# EAGLE schematic BORC_v2_control_board (EAGLE 9.6.2)

## Sheet 1 of 4: Main Processor & interfaces
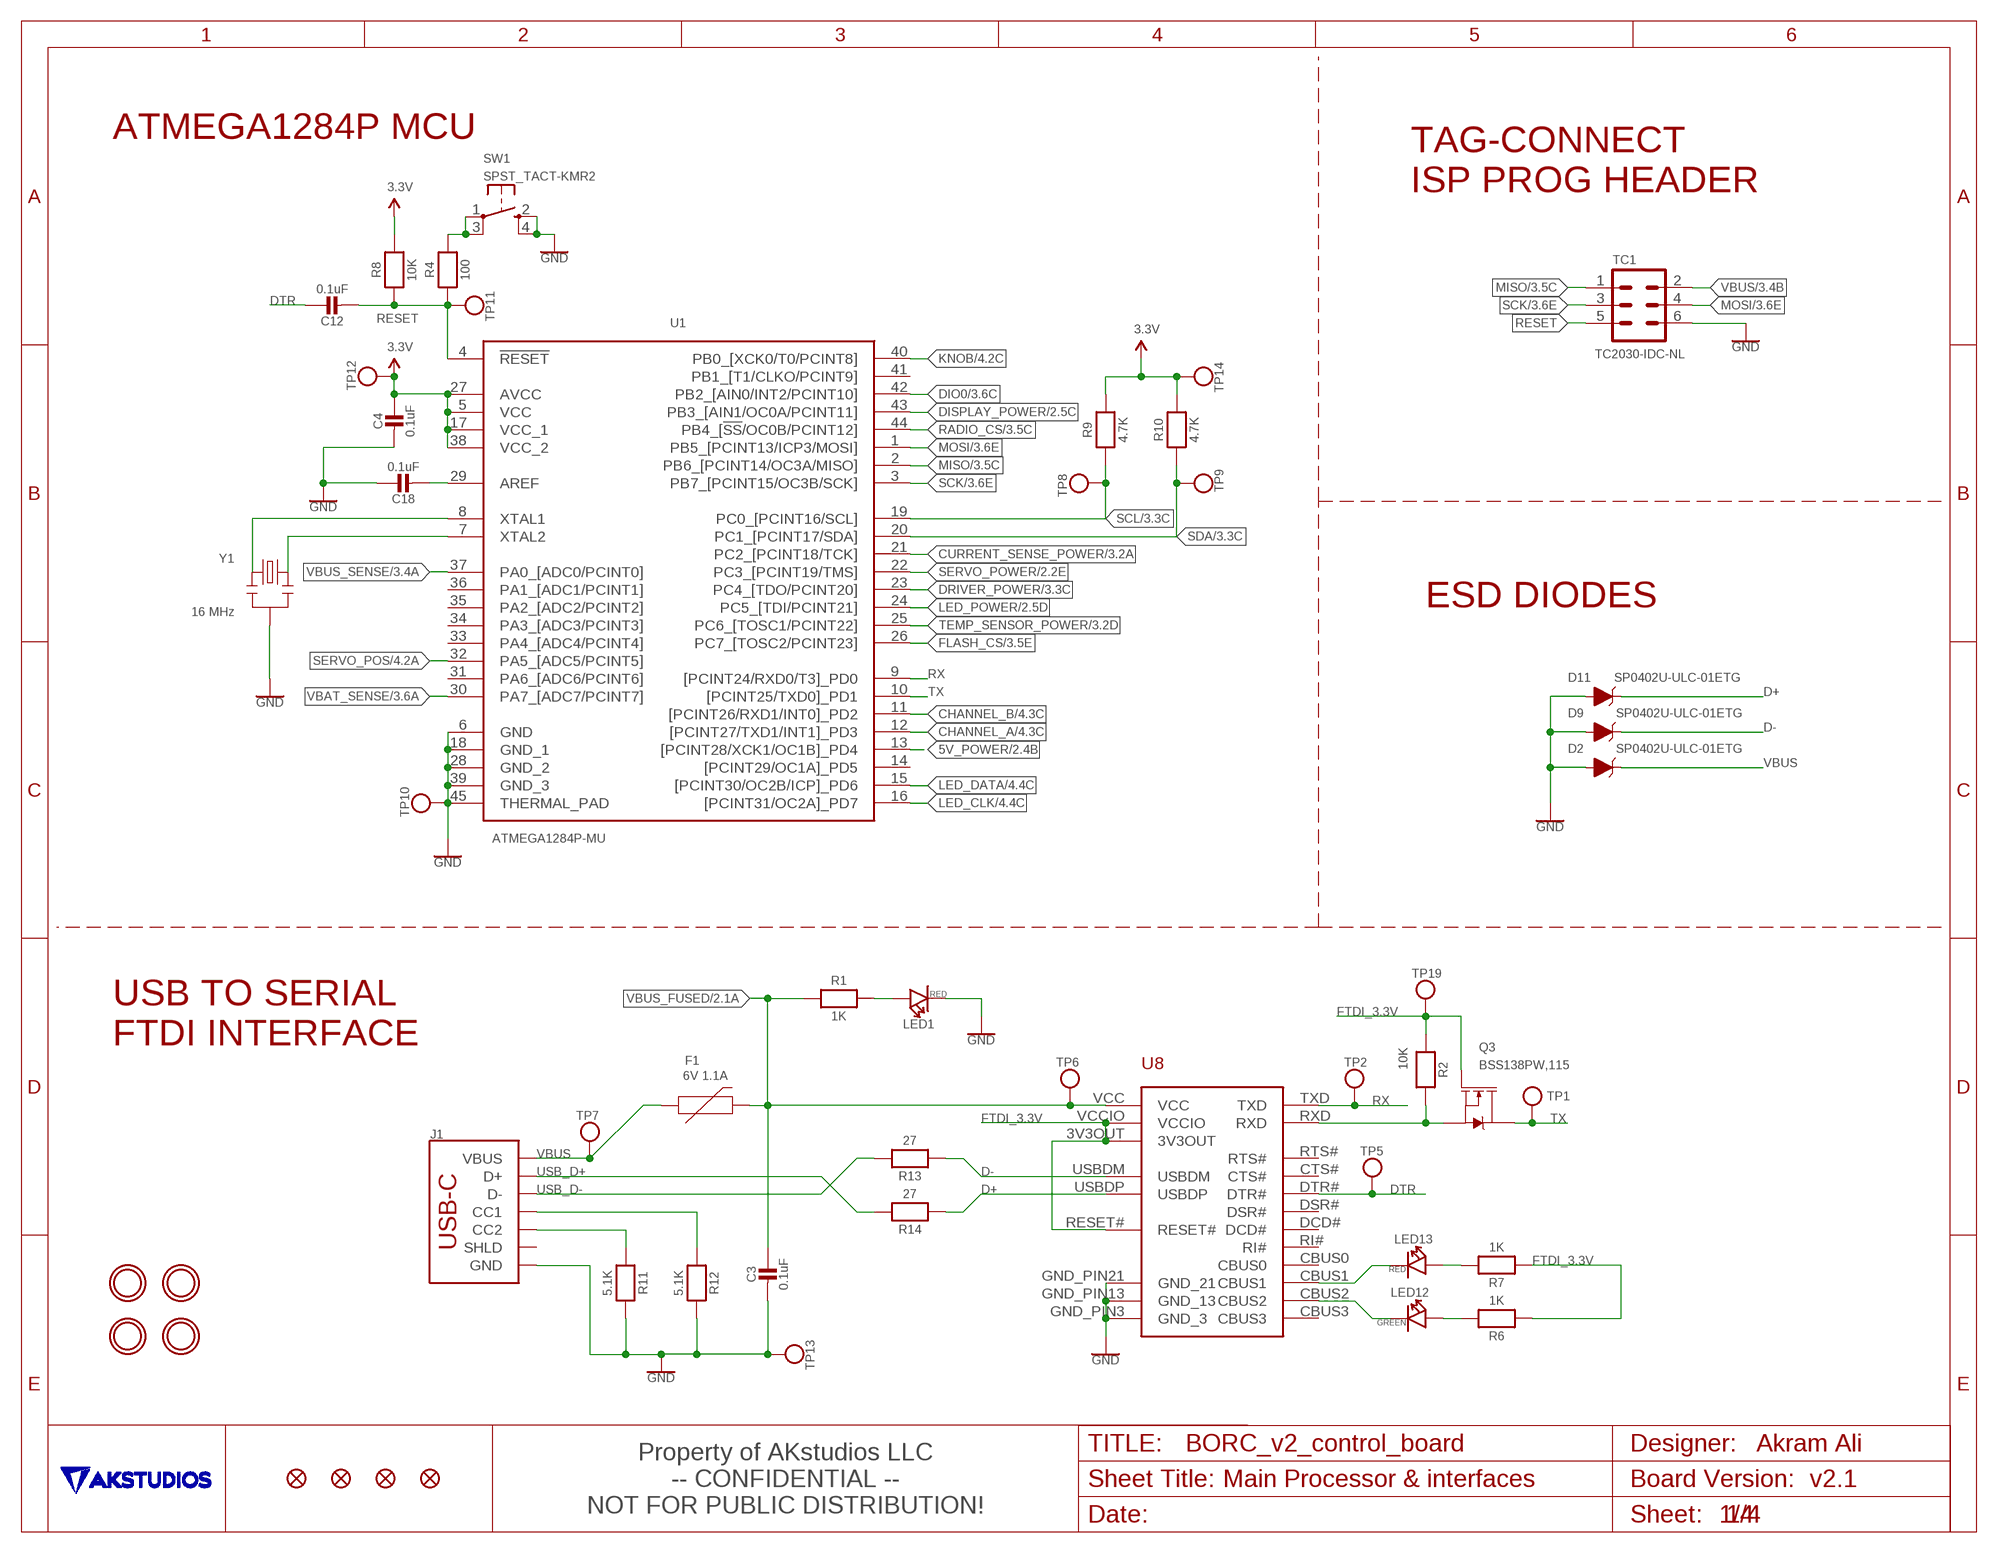
[diagram p0: schematic, sheet 1]

### Parts
C3  0.1uF  MICROBUILDER_CAP_CERAMIC_0402MP  [MICROBUILDER__0402MP]
C4  0.1uF  MICROBUILDER_CAP_CERAMIC_0402MP  [MICROBUILDER__0402MP]
C12  0.1uF  MICROBUILDER_CAP_CERAMIC_0402MP  [MICROBUILDER__0402MP]
C18  0.1uF  MICROBUILDER_CAP_CERAMIC_0402MP  [MICROBUILDER__0402MP]
D2  SP0402U-ULC-01ETG  [0402]
D9  SP0402U-ULC-01ETG  [0402]
D11  SP0402U-ULC-01ETG  [0402]
F1  6V 1.1A  PPTC_6V500MA  [0805]
FID1  FIDUCIAL""  [FIDUCIAL_1MM]
FID2  FIDUCIAL""  [FIDUCIAL_1MM]
FID3  FIDUCIAL""  [FIDUCIAL_1MM]
FID4  FIDUCIAL""  [FIDUCIAL_1MM]
J1  USB Female Type C Connector  USB_C_2-LAYER_PADS  [USB-C-16P-2LAYER-PADS]
LED1  RED  SMD-LED-CLEAR-BLUE(0402)  [LED-0402]
LED12  GREEN  SMD-LED-CLEAR-BLUE(0402)  [LED-0402]
LED13  RED  SMD-LED-CLEAR-BLUE(0402)  [LED-0402]
MH1  MOUNTINGHOLE2.5  [MOUNTINGHOLE_2.5_PLATED]
Q3  BSS138PW,115  MOSFET-NCH-BSS138PW,115  [SOT323]
R1  1K  MICROBUILDER_RESISTOR_0402MP  [MICROBUILDER__0402MP]
R2  10K  MICROBUILDER_RESISTOR_0402MP  [MICROBUILDER__0402MP]
R4  100  MICROBUILDER_RESISTOR_0402MP  [MICROBUILDER__0402MP]
R6  1K  MICROBUILDER_RESISTOR_0402MP  [MICROBUILDER__0402MP]
R7  1K  MICROBUILDER_RESISTOR_0402MP  [MICROBUILDER__0402MP]
R8  10K  MICROBUILDER_RESISTOR_0402MP  [MICROBUILDER__0402MP]
R9  4.7K  MICROBUILDER_RESISTOR_0402MP  [MICROBUILDER__0402MP]
R10  4.7K  MICROBUILDER_RESISTOR_0402MP  [MICROBUILDER__0402MP]
R11  5.1K  MICROBUILDER_RESISTOR_0402MP  [MICROBUILDER__0402MP]
R12  5.1K  MICROBUILDER_RESISTOR_0402MP  [MICROBUILDER__0402MP]
R13  27  MICROBUILDER_RESISTOR_0402MP  [MICROBUILDER__0402MP]
R14  27  MICROBUILDER_RESISTOR_0402MP  [MICROBUILDER__0402MP]
SW1  SPST_TACT-KMR2  [KMR2]
TC1  TC2030-IDC-NL  [TC2030-IDC-NL]
TP1  TX  MICROBUILDER_TESTPOINTROUND1MM  [MICROBUILDER_TESTPOINT_ROUND_1MM]
TP2  RX  MICROBUILDER_TESTPOINTROUND1MM  [MICROBUILDER_TESTPOINT_ROUND_1MM]
TP5  RX  MICROBUILDER_TESTPOINTROUND1MM  [MICROBUILDER_TESTPOINT_ROUND_1MM]
TP6  RX  MICROBUILDER_TESTPOINTROUND1MM  [MICROBUILDER_TESTPOINT_ROUND_1MM]
TP7  RX  MICROBUILDER_TESTPOINTROUND1MM  [MICROBUILDER_TESTPOINT_ROUND_1MM]
TP8  RX  MICROBUILDER_TESTPOINTROUND1MM  [MICROBUILDER_TESTPOINT_ROUND_1MM]
TP9  RX  MICROBUILDER_TESTPOINTROUND1MM  [MICROBUILDER_TESTPOINT_ROUND_1MM]
TP10  RX  MICROBUILDER_TESTPOINTROUND1MM  [MICROBUILDER_TESTPOINT_ROUND_1MM]
TP11  RX  MICROBUILDER_TESTPOINTROUND1MM  [MICROBUILDER_TESTPOINT_ROUND_1MM]
TP12  RX  MICROBUILDER_TESTPOINTROUND1MM  [MICROBUILDER_TESTPOINT_ROUND_1MM]
TP13  RX  MICROBUILDER_TESTPOINTROUND1MM  [MICROBUILDER_TESTPOINT_ROUND_1MM]
TP14  RX  MICROBUILDER_TESTPOINTROUND1MM  [MICROBUILDER_TESTPOINT_ROUND_1MM]
TP19  RX  MICROBUILDER_TESTPOINTROUND1MM  [MICROBUILDER_TESTPOINT_ROUND_1MM]
U1  ATMEGA1284P-MU  [QFN50P700X700X100-45N]
U8  FT231XQ-R  [FTDI_FT231XQ-R_PACKAGE]
U$3  MOUNTINGHOLE2.5  [MOUNTINGHOLE_2.5_PLATED]
U$4  MOUNTINGHOLE2.5  [MOUNTINGHOLE_2.5_PLATED]
U$7  MOUNTINGHOLE2.5  [MOUNTINGHOLE_2.5_PLATED]
Y1  16 MHz  RESONATORSMD  [RESONATOR-SMD]

### Nets
5V_POWER: U1.13([PCINT28/XCK1/OC1B]_PD4) ; also sheet 2
CHANNEL_A: U1.12([PCINT27/TXD1/INT1]_PD3) ; also sheet 4
CHANNEL_B: U1.11([PCINT26/RXD1/INT0]_PD2) ; also sheet 4
CURRENT_SENSE_POWER: U1.21(PC2_[PCINT18/TCK]) ; also sheet 3
D+: D11.C R14.1 U8.USBDP
D-: D9.C R13.1 U8.USBDM
DIO0: U1.42(PB2_[AIN0/INT2/PCINT10]) ; also sheet 3
DISPLAY_POWER: U1.43(PB3_[AIN1/OC0A/PCINT11]) ; also sheet 2
DRIVER_POWER: U1.23(PC4_[TDO/PCINT20]) ; also sheet 3
DTR: C12.1 TP5.P$1 U8.DTR#
FLASH_CS: U1.26(PC7_[TOSC2/PCINT23]) ; also sheet 3
FTDI_3.3V: Q3.1(G) R2.1 R6.1 R7.1 TP19.P$1 U8.3V3OUT U8.RESET# U8.VCCIO
GND [power]: C3.2 C4.2 C18.1 D2.A D9.A D11.A J1.GND J1.GND2(GND) LED1.- R11.2 R12.2 SW1.2(S) SW1.4(S1) TC1.6 TP10.P$1 TP13.P$1 U1.6(GND) U1.18(GND_1) U1.28(GND_2) U1.39(GND_3) U1.45(THERMAL_PAD) U8.GND_PIN3(GND_3) U8.GND_PIN13(GND_13) U8.GND_PIN21(GND_21) Y1.2 ; also sheet 2,3,4
KNOB: U1.40(PB0_[XCK0/T0/PCINT8]) ; also sheet 4
LED_CLK: U1.16([PCINT31/OC2A]_PD7) ; also sheet 4
LED_DATA: U1.15([PCINT30/OC2B/ICP]_PD6) ; also sheet 4
LED_POWER: U1.24(PC5_[TDI/PCINT21]) ; also sheet 2
MISO: TC1.1 U1.2(PB6_[PCINT14/OC3A/MISO]) ; also sheet 3
MOSI: TC1.4 U1.1(PB5_[PCINT13/ICP3/MOSI]) ; also sheet 3
N$1: U1.8(XTAL1) Y1.1
N$2: LED1.+ R1.2
N$3: U1.7(XTAL2) Y1.3
N$4: J1.B5(CC2) R11.1
N$5: J1.A5(CC1) R12.1
N$6: LED12.+ R6.2
N$7: LED13.- U8.CBUS1
N$8: C18.2 U1.29(AREF)
N$10: LED12.- U8.CBUS2
N$12: R4.2 SW1.1(P) SW1.3(P1)
N$14: Q3.2(S) R2.2 U8.RXD
N$17: LED13.+ R7.2
RADIO_CS: U1.44(PB4_[!SS!/OC0B/PCINT12]) ; also sheet 3
RESET: C12.2 R4.1 R8.1 TC1.5 TP11.P$1 U1.4(!RESET)
RX: TP2.P$1 U1.9([PCINT24/RXD0/T3]_PD0) U8.TXD
SCK: TC1.3 U1.3(PB7_[PCINT15/OC3B/SCK]) ; also sheet 3
SCL: R9.1 TP8.P$1 U1.19(PC0_[PCINT16/SCL]) ; also sheet 3,4
SDA: R10.1 TP9.P$1 U1.20(PC1_[PCINT17/SDA]) ; also sheet 3,4
SERVO_POS: U1.32(PA5_[ADC5/PCINT5]) ; also sheet 4
SERVO_POWER: U1.22(PC3_[PCINT19/TMS]) ; also sheet 2
TEMP_SENSOR_POWER: U1.25(PC6_[TOSC1/PCINT22]) ; also sheet 3
TX: Q3.3(D) TP1.P$1 U1.10([PCINT25/TXD0]_PD1)
USB_D+: J1.A6(D+) J1.B6(D+) R14.2
USB_D-: J1.A7(D-) J1.B7(D-) R13.2
VBAT_SENSE: U1.30(PA7_[ADC7/PCINT7]) ; also sheet 3
VBUS [power]: D2.C F1.1 J1.VBUS1(VBUS) J1.VBUS2(VBUS) TC1.2 TP7.P$1 ; also sheet 3
VBUS_FUSED [power]: C3.1 F1.2 R1.1 TP6.P$1 U8.VCC ; also sheet 2
VBUS_SENSE: U1.37(PA0_[ADC0/PCINT0]) ; also sheet 3
VCC: C4.1 R8.2 R9.2 R10.2 TP12.P$1 TP14.P$1 U1.5(VCC) U1.17(VCC_1) U1.27(AVCC) U1.38(VCC_2) ; supply symbol labelled 3.3V ; also sheet 2,3,4
Unconnected: J1.SHLD1(SHLD) J1.SHLD2(SHLD) J1.SHLD3(SHLD) J1.SHLD4(SHLD) U1.14([PCINT29/OC1A]_PD5) U1.31(PA6_[ADC6/PCINT6]) U1.33(PA4_[ADC4/PCINT4]) U1.34(PA3_[ADC3/PCINT3]) U1.35(PA2_[ADC2/PCINT2]) U1.36(PA1_[ADC1/PCINT1]) U1.41(PB1_[T1/CLKO/PCINT9]) U8.CBUS0 U8.CBUS3 U8.CTS# U8.DCD# U8.DSR# U8.RI# U8.RTS#

### Notes on the sheet
- ATMEGA1284P MCU
- TAG-CONNECT
  ISP PROG HEADER
- ESD DIODES
- USB TO SERIAL
  FTDI INTERFACE
- Akram Ali
- Property of AKstudios LLC
- v2.1
- -- CONFIDENTIAL --
  NOT FOR PUBLIC DISTRIBUTION!

## Sheet 2 of 4: Power Regulation & Control
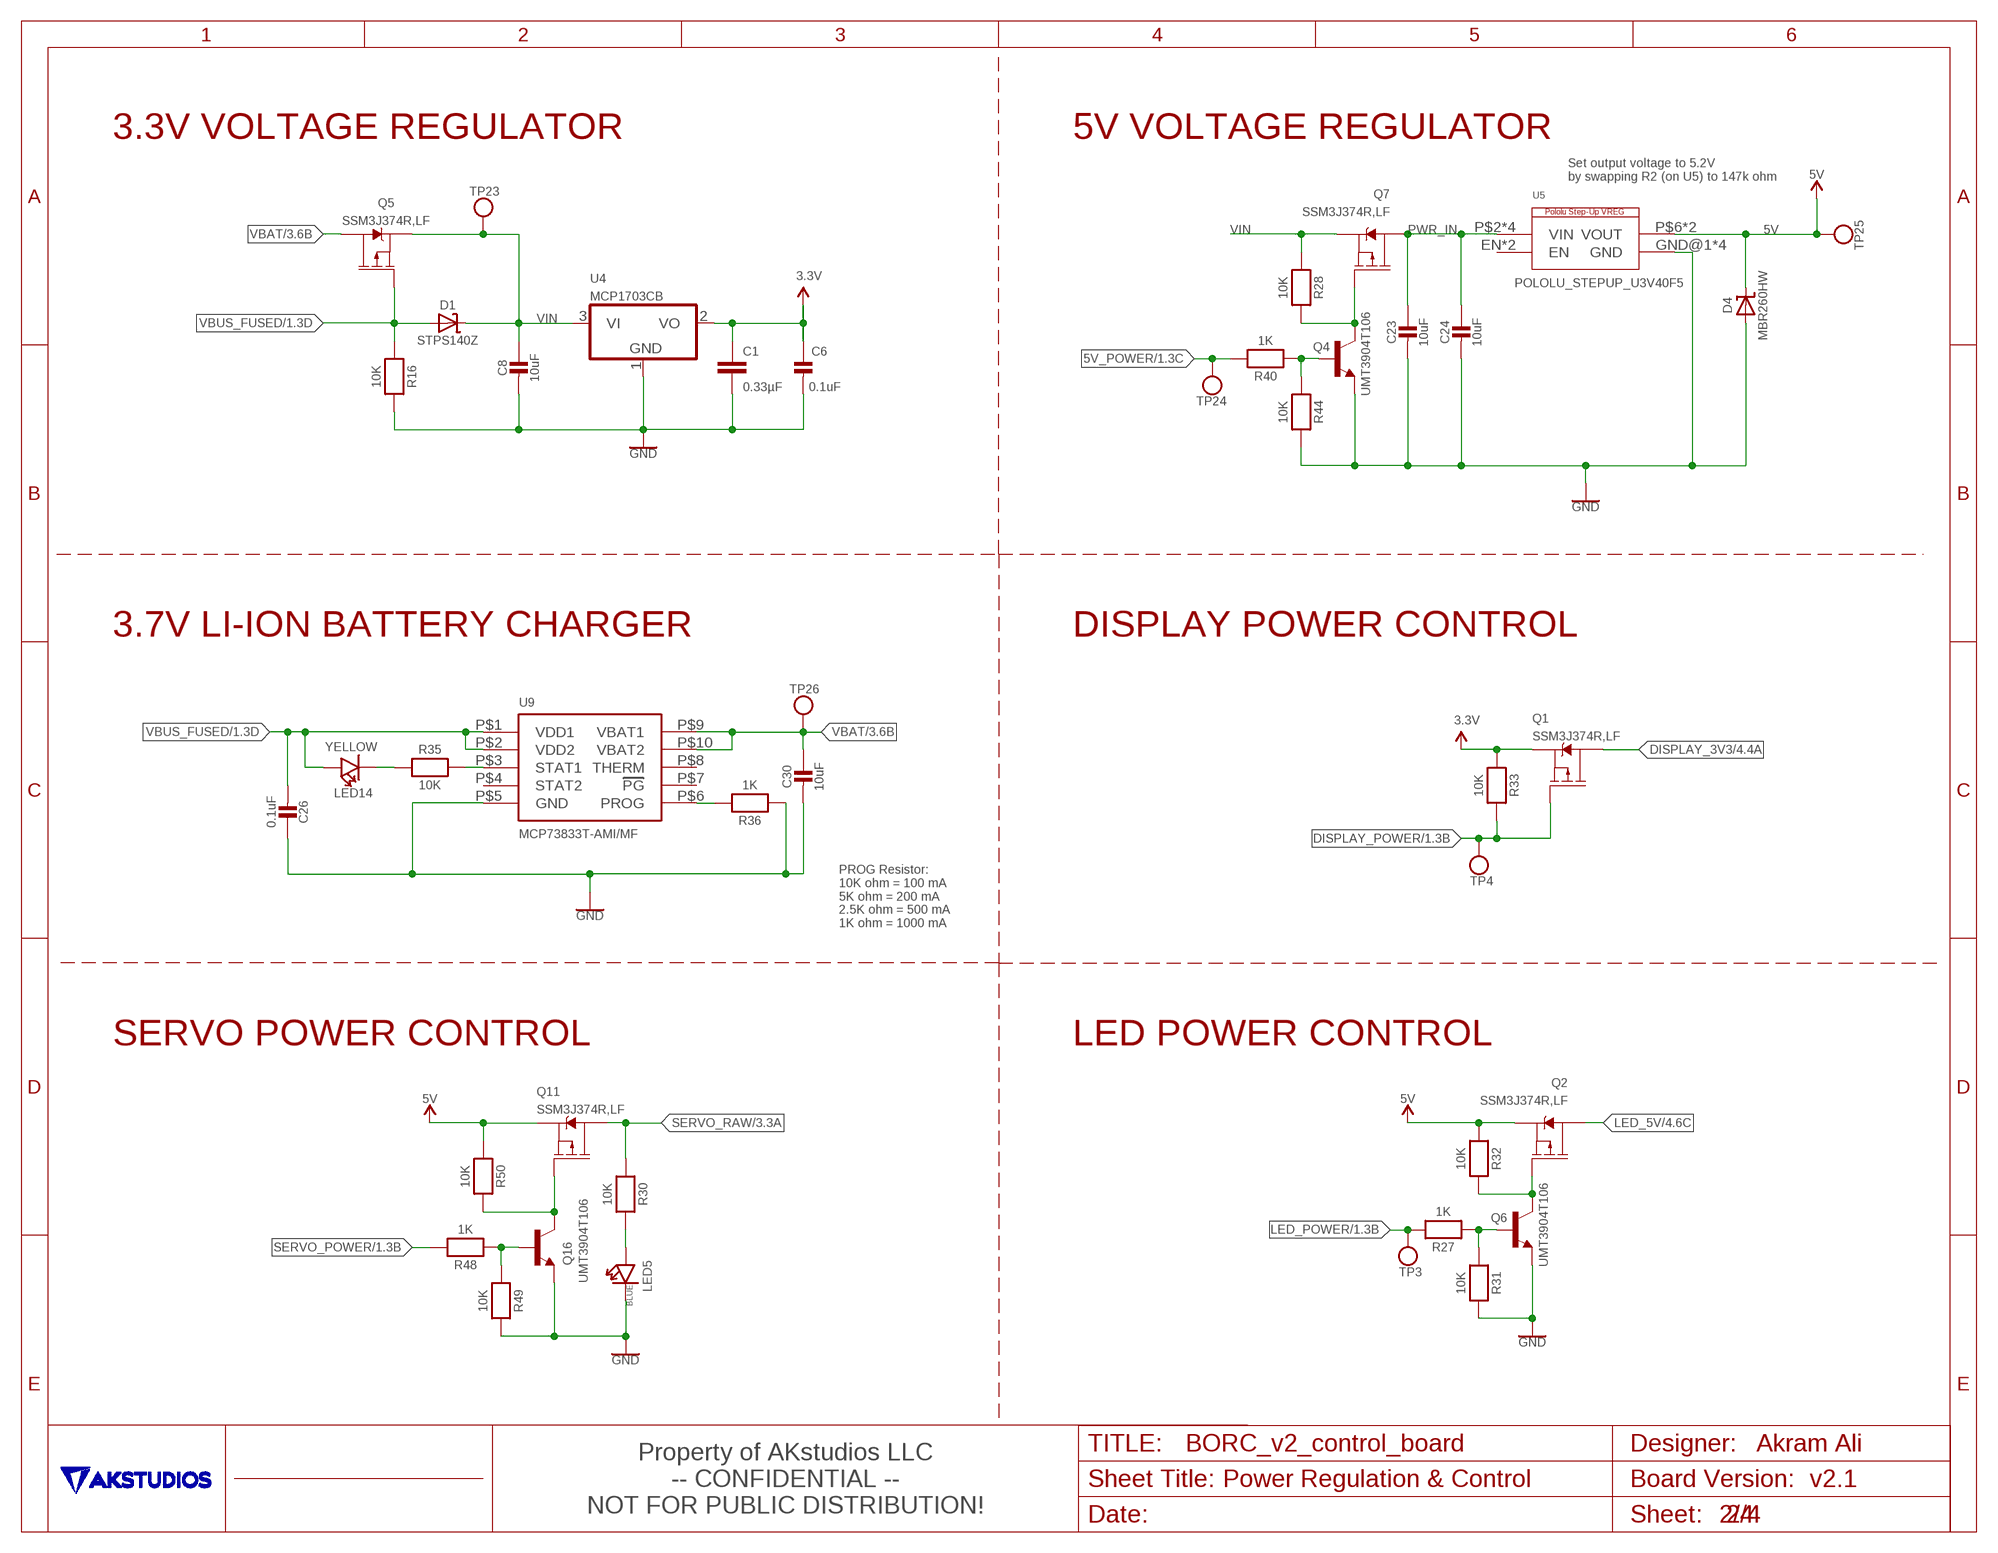
[diagram p1: schematic, sheet 2]

### Parts
C1  0.33µF  0.33UF/330NF-0805-50V-10%  [0805]
C6  0.1uF  MICROBUILDER_CAP_CERAMIC_0402MP  [MICROBUILDER__0402MP]
C8  10uF  MICROBUILDER_CAP_CERAMIC_0402MP  [MICROBUILDER__0402MP]
C23  10uF  MICROBUILDER_CAP_CERAMIC_0402MP  [MICROBUILDER__0402MP]
C24  10uF  MICROBUILDER_CAP_CERAMIC_0402MP  [MICROBUILDER__0402MP]
C26  0.1uF  MICROBUILDER_CAP_CERAMIC_0402MP  [MICROBUILDER__0402MP]
C30  10uF  MICROBUILDER_CAP_CERAMIC_0402MP  [MICROBUILDER__0402MP]
D1  STPS140Z  DIODE-SCHOTTKYSOD-123  [SOD-123]
D4  MBR260HW  DIODE-SCHOTTKYSOD-123  [SOD-123]
LED5  BLUE  SMD-LED-CLEAR-BLUE(0402)  [LED-0402]
LED14  YELLOW  SMD-LED-CLEAR-BLUE(0402)  [LED-0402]
Q1  SSM3J374R,LF  MOSFET-PCH-BSS84  [SOT23-3]
Q2  SSM3J374R,LF  MOSFET-PCH-BSS84  [SOT23-3]
Q4  UMT3904T106  [SOT65P210X100-3N]
Q5  SSM3J374R,LF  MOSFET-PCH-BSS84  [SOT23-3]
Q6  UMT3904T106  [SOT65P210X100-3N]
Q7  SSM3J374R,LF  MOSFET-PCH-BSS84  [SOT23-3]
Q11  SSM3J374R,LF  MOSFET-PCH-BSS84  [SOT23-3]
Q16  UMT3904T106  [SOT65P210X100-3N]
R16  10K  MICROBUILDER_RESISTOR_0402MP  [MICROBUILDER__0402MP]
R27  1K  MICROBUILDER_RESISTOR_0402MP  [MICROBUILDER__0402MP]
R28  10K  MICROBUILDER_RESISTOR_0402MP  [MICROBUILDER__0402MP]
R30  10K  MICROBUILDER_RESISTOR_0402MP  [MICROBUILDER__0402MP]
R31  10K  MICROBUILDER_RESISTOR_0402MP  [MICROBUILDER__0402MP]
R32  10K  MICROBUILDER_RESISTOR_0402MP  [MICROBUILDER__0402MP]
R33  10K  MICROBUILDER_RESISTOR_0402MP  [MICROBUILDER__0402MP]
R35  10K  MICROBUILDER_RESISTOR_0402MP  [MICROBUILDER__0402MP]
R36  1K  MICROBUILDER_RESISTOR_0402MP  [MICROBUILDER__0402MP]
R40  1K  MICROBUILDER_RESISTOR_0402MP  [MICROBUILDER__0402MP]
R44  10K  MICROBUILDER_RESISTOR_0402MP  [MICROBUILDER__0402MP]
R48  1K  MICROBUILDER_RESISTOR_0402MP  [MICROBUILDER__0402MP]
R49  10K  MICROBUILDER_RESISTOR_0402MP  [MICROBUILDER__0402MP]
R50  10K  MICROBUILDER_RESISTOR_0402MP  [MICROBUILDER__0402MP]
TP3  RX  MICROBUILDER_TESTPOINTROUND1MM  [MICROBUILDER_TESTPOINT_ROUND_1MM]
TP4  RX  MICROBUILDER_TESTPOINTROUND1MM  [MICROBUILDER_TESTPOINT_ROUND_1MM]
TP23  RX  MICROBUILDER_TESTPOINTROUND1MM  [MICROBUILDER_TESTPOINT_ROUND_1MM]
TP24  RX  MICROBUILDER_TESTPOINTROUND1MM  [MICROBUILDER_TESTPOINT_ROUND_1MM]
TP25  RX  MICROBUILDER_TESTPOINTROUND1MM  [MICROBUILDER_TESTPOINT_ROUND_1MM]
TP26  RX  MICROBUILDER_TESTPOINTROUND1MM  [MICROBUILDER_TESTPOINT_ROUND_1MM]
U4  MCP1703CB  [SOT23]
U5  POLOLU_STEPUP_U3V40F5  POLOLU_STEPUP_U3V40X  [POLOLU_STEPUP_U3V40X]
U9  MCP73833T-AMI/MF  MCP73833DFN  [DFN10_3X3MM]

### Nets
5V [power]: D4.C Q2.2(S1) Q11.2(S1) R32.1 R50.1 TP25.P$1 U5.P$6(VOUT) U5.VOUT
5V_POWER: R40.2 TP24.P$1 ; also sheet 1
DISPLAY_3V3: Q1.3(D1) ; also sheet 4
DISPLAY_POWER: Q1.1(G1) R33.2 TP4.P$1 ; also sheet 1
GND [power]: C1.2 C6.2 C8.2 C23.2 C24.2 C26.1 C30.2 D4.A LED5.- Q4.2(E) Q6.2(E) Q16.2(E) R16.2 R31.2 R36.1 R44.2 R49.2 U4.1(GND) U5.GND@1(GND) U5.GND@2(GND) U5.P$4(GND) U5.P$5(GND) U9.P$5(GND) ; also sheet 1,3,4
LED_5V: Q2.3(D1) ; also sheet 4
LED_POWER: R27.2 TP3.P$1 ; also sheet 1
N$9: R35.2 U9.P$3(STAT1)
N$16: LED14.- R35.1
N$18: Q2.1(G1) Q6.3(C) R32.2
N$20: Q6.1(B) R27.1 R31.1
N$24: Q11.1(G1) Q16.3(C) R50.2
N$27: R36.2 U9.P$6(PROG)
N$31: Q4.3(C) Q7.1(G1) R28.2
N$34: Q4.1(B) R40.1 R44.1
N$45: Q16.1(B) R48.1 R49.1
N$46: LED5.+ R30.2
PWR_IN: C23.1 C24.1 Q7.3(D1) U5.P$2(VIN) U5.P$3(VIN) U5.VIN@1(VIN) U5.VIN@2(VIN)
SERVO_POWER: R48.2 ; also sheet 1
SERVO_RAW: Q11.3(D1) R30.1 ; also sheet 3
VBAT: C30.1 Q5.3(D1) TP26.P$1 U9.P$9(VBAT1) U9.P$10(VBAT2) ; also sheet 3,4
VBUS_FUSED [power]: C26.2 D1.A LED14.+ Q5.1(G1) R16.1 U9.P$1(VDD1) U9.P$2(VDD2) ; also sheet 1
VCC: C1.1 C6.1 Q1.2(S1) R33.1 U4.2(VO) ; supply symbol labelled 3.3V ; also sheet 1,3,4
VIN [power]: C8.1 D1.C Q5.2(S1) Q7.2(S1) R28.1 TP23.P$1 U4.3(VI)
Unconnected: U5.EN U5.P$1(EN) U9.P$4(STAT2) U9.P$7(PG) U9.P$8(THERM)

### Notes on the sheet
- 3.3V VOLTAGE REGULATOR | 5V VOLTAGE REGULATOR
- Set output voltage to 5.2V
  by swapping R2 (on U5) to 147k ohm
- 3.7V LI-ION BATTERY CHARGER | DISPLAY POWER CONTROL
- PROG Resistor:
  10K ohm = 100 mA
  5K ohm = 200 mA
  2.5K ohm = 500 mA
  1K ohm = 1000 mA
- SERVO POWER CONTROL | LED POWER CONTROL
- Akram Ali
- Property of AKstudios LLC
- v2.1
- -- CONFIDENTIAL --
  NOT FOR PUBLIC DISTRIBUTION!

## Sheet 3 of 4: Sensors & ICs
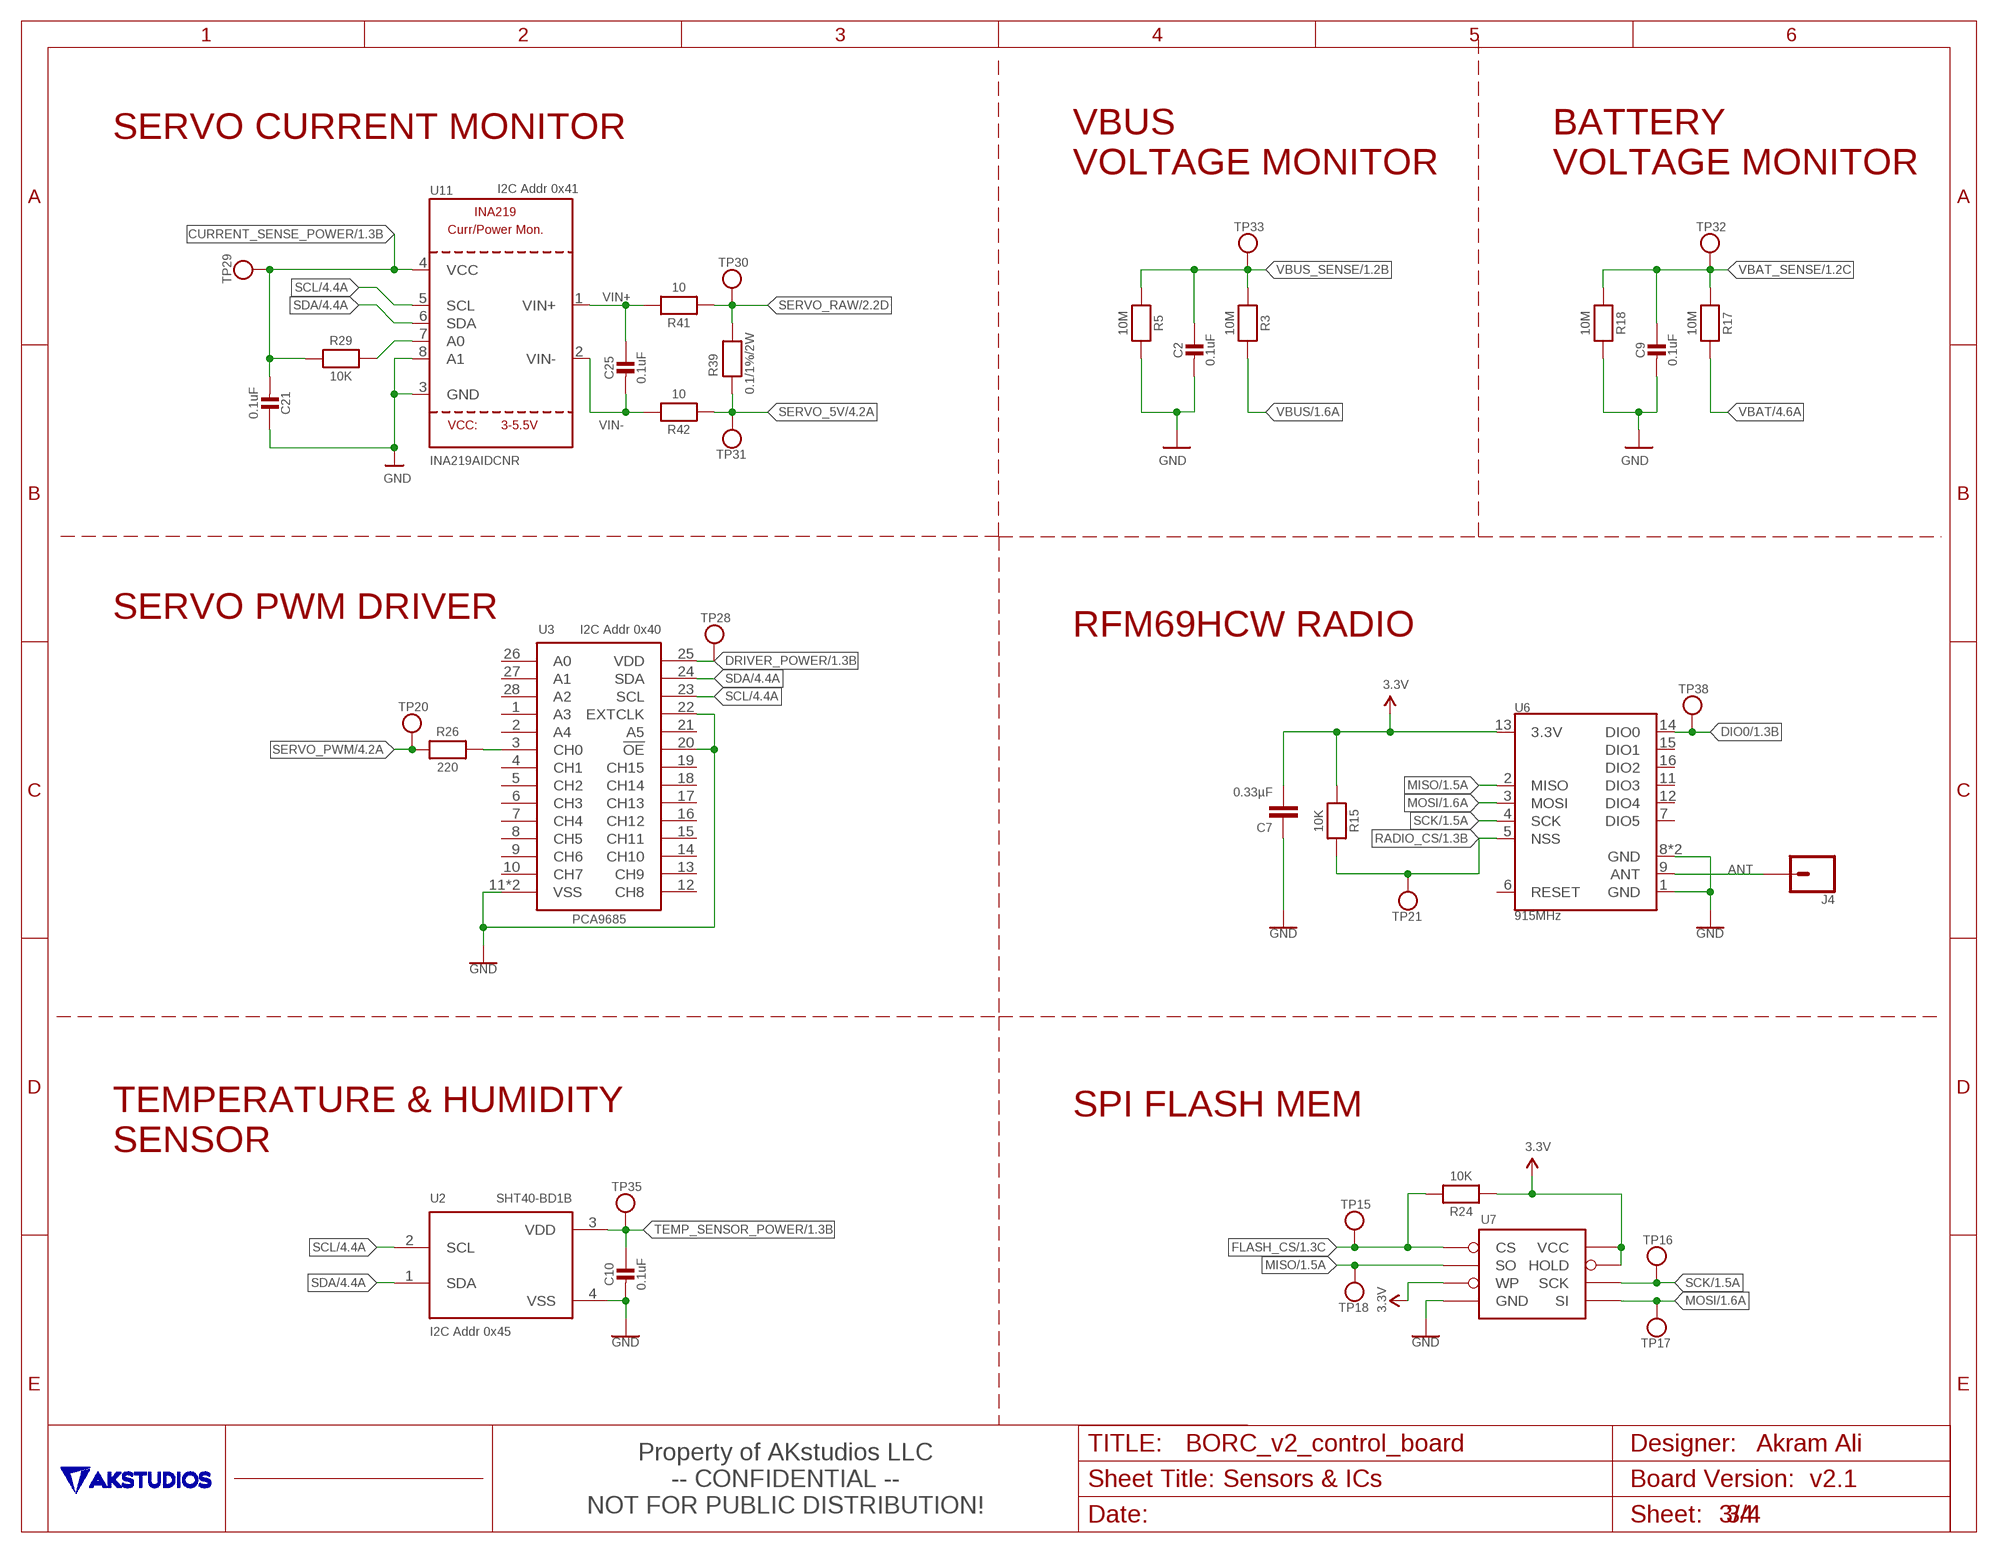
[diagram p2: schematic, sheet 3]

### Parts
C2  0.1uF  MICROBUILDER_CAP_CERAMIC_0402MP  [MICROBUILDER__0402MP]
C7  0.33µF  0.33UF/330NF-0805-50V-10%  [0805]
C9  0.1uF  MICROBUILDER_CAP_CERAMIC_0402MP  [MICROBUILDER__0402MP]
C10  0.1uF  MICROBUILDER_CAP_CERAMIC_0402MP  [MICROBUILDER__0402MP]
C21  0.1uF  MICROBUILDER_CAP_CERAMIC_0402MP  [MICROBUILDER__0402MP]
C25  0.1uF  MICROBUILDER_CAP_CERAMIC_0402MP  [MICROBUILDER__0402MP]
J4  CONN_01  [1X01]
R3  10M  MICROBUILDER_RESISTOR_0402MP  [MICROBUILDER__0402MP]
R5  10M  MICROBUILDER_RESISTOR_0402MP  [MICROBUILDER__0402MP]
R15  10K  MICROBUILDER_RESISTOR_0402MP  [MICROBUILDER__0402MP]
R17  10M  MICROBUILDER_RESISTOR_0402MP  [MICROBUILDER__0402MP]
R18  10M  MICROBUILDER_RESISTOR_0402MP  [MICROBUILDER__0402MP]
R24  10K  MICROBUILDER_RESISTOR_0402MP  [MICROBUILDER__0402MP]
R26  220  MICROBUILDER_RESISTOR_0402MP  [MICROBUILDER__0402MP]
R29  10K  MICROBUILDER_RESISTOR_0402MP  [MICROBUILDER__0402MP]
R39  0.1/1%/2W  RESISTOR2512  [2512]
R41  10  MICROBUILDER_RESISTOR_0402MP  [MICROBUILDER__0402MP]
R42  10  MICROBUILDER_RESISTOR_0402MP  [MICROBUILDER__0402MP]
TP15  RX  MICROBUILDER_TESTPOINTROUND1MM  [MICROBUILDER_TESTPOINT_ROUND_1MM]
TP16  RX  MICROBUILDER_TESTPOINTROUND1MM  [MICROBUILDER_TESTPOINT_ROUND_1MM]
TP17  RX  MICROBUILDER_TESTPOINTROUND1MM  [MICROBUILDER_TESTPOINT_ROUND_1MM]
TP18  RX  MICROBUILDER_TESTPOINTROUND1MM  [MICROBUILDER_TESTPOINT_ROUND_1MM]
TP20  RX  MICROBUILDER_TESTPOINTROUND1MM  [MICROBUILDER_TESTPOINT_ROUND_1MM]
TP21  RX  MICROBUILDER_TESTPOINTROUND1MM  [MICROBUILDER_TESTPOINT_ROUND_1MM]
TP28  RX  MICROBUILDER_TESTPOINTROUND1MM  [MICROBUILDER_TESTPOINT_ROUND_1MM]
TP29  RX  MICROBUILDER_TESTPOINTROUND1MM  [MICROBUILDER_TESTPOINT_ROUND_1MM]
TP30  RX  MICROBUILDER_TESTPOINTROUND1MM  [MICROBUILDER_TESTPOINT_ROUND_1MM]
TP31  RX  MICROBUILDER_TESTPOINTROUND1MM  [MICROBUILDER_TESTPOINT_ROUND_1MM]
TP32  RX  MICROBUILDER_TESTPOINTROUND1MM  [MICROBUILDER_TESTPOINT_ROUND_1MM]
TP33  RX  MICROBUILDER_TESTPOINTROUND1MM  [MICROBUILDER_TESTPOINT_ROUND_1MM]
TP35  RX  MICROBUILDER_TESTPOINTROUND1MM  [MICROBUILDER_TESTPOINT_ROUND_1MM]
TP38  RX  MICROBUILDER_TESTPOINTROUND1MM  [MICROBUILDER_TESTPOINT_ROUND_1MM]
U2  SHT40-BD1B  SHT40-AD1B-R3  [SHT4X]
U3  PCA9685  PCA9685HVQFN28  [HVQFN28_SOT788-1]
U6  915MHz  RFM69HCW-915  [RFM69HCW-XXXS2]
U7  AT25F512BJEDEC_3.9MM  [SO08]
U11  INA219AIDCNR  INA219  [SOT23-8]

### Nets
ANT: J4.1 U6.9(ANT)
CURRENT_SENSE_POWER: C21.2 R29.1 TP29.P$1 U11.4(VCC) ; also sheet 1
DIO0: TP38.P$1 U6.14(DIO0) ; also sheet 1
DRIVER_POWER: TP28.P$1 U3.25(VDD) ; also sheet 1
FLASH_CS: R24.2 TP15.P$1 U7.1_CS(CS) ; also sheet 1
GND [power]: C2.2 C7.1 C9.2 C10.2 C21.1 R5.2 R18.2 U2.4(VSS) U3.11(VSS) U3.20(!OE) U3.22(EXTCLK) U3.TH(VSS) U6.1(GND) U6.8(GND) U6.10(GND) U7.4_GND(GND) U11.3(GND) U11.8(A1) ; also sheet 1,2,4
MISO: TP18.P$1 U6.2(MISO) U7.2_SO(SO) ; also sheet 1
MOSI: TP17.P$1 U6.3(MOSI) U7.5_SI(SI) ; also sheet 1
N$13: R26.2 U3.3(CH0)
N$15: R29.2 U11.7(A0)
RADIO_CS: R15.2 TP21.P$1 U6.5(NSS) ; also sheet 1
SCK: TP16.P$1 U6.4(SCK) U7.6_SCK(SCK) ; also sheet 1
SCL: U2.2(SCL) U3.23(SCL) U11.5(SCL) ; also sheet 1,4
SDA: U2.1(SDA) U3.24(SDA) U11.6(SDA) ; also sheet 1,4
SERVO_5V: R39.1 R42.1 TP31.P$1 ; also sheet 4
SERVO_PWM: R26.1 TP20.P$1 ; also sheet 4
SERVO_RAW: R39.2 R41.1 TP30.P$1 ; also sheet 2
TEMP_SENSOR_POWER: C10.1 TP35.P$1 U2.3(VDD) ; also sheet 1
VBAT: R17.2 ; also sheet 2,4
VBAT_SENSE: C9.1 R17.1 R18.1 TP32.P$1 ; also sheet 1
VBUS [power]: R3.2 ; also sheet 1
VBUS_SENSE: C2.1 R3.1 R5.1 TP33.P$1 ; also sheet 1
VCC: C7.2 R15.1 R24.1 U6.13(3.3V) U7.3_WP(WP) U7.7_HOLD(HOLD) U7.8_VCC(VCC) ; supply symbol labelled 3.3V ; also sheet 1,2,4
VIN+: C25.1 R41.2 U11.1(VIN+)
VIN-: C25.2 R42.2 U11.2(VIN-)
Unconnected: U3.1(A3) U3.2(A4) U3.4(CH1) U3.5(CH2) U3.6(CH3) U3.7(CH4) U3.8(CH5) U3.9(CH6) U3.10(CH7) U3.12(CH8) U3.13(CH9) U3.14(CH10) U3.15(CH11) U3.16(CH12) U3.17(CH13) U3.18(CH14) U3.19(CH15) U3.21(A5) U3.26(A0) U3.27(A1) U3.28(A2) U6.6(RESET) U6.7(DIO5) U6.11(DIO3) U6.12(DIO4) U6.15(DIO1) U6.16(DIO2)

### Notes on the sheet
- SERVO CURRENT MONITOR
- VBUS
  VOLTAGE MONITOR
- BATTERY
  VOLTAGE MONITOR
- I2C Addr 0x41
- SERVO PWM DRIVER
- I2C Addr 0x40
- RFM69HCW RADIO
- SPI FLASH MEM
- TEMPERATURE & HUMIDITY
  SENSOR
- I2C Addr 0x45
- Akram Ali
- Property of AKstudios LLC
- v2.1
- -- CONFIDENTIAL --
  NOT FOR PUBLIC DISTRIBUTION!

## Sheet 4 of 4: Ports, Buttons & LEDs
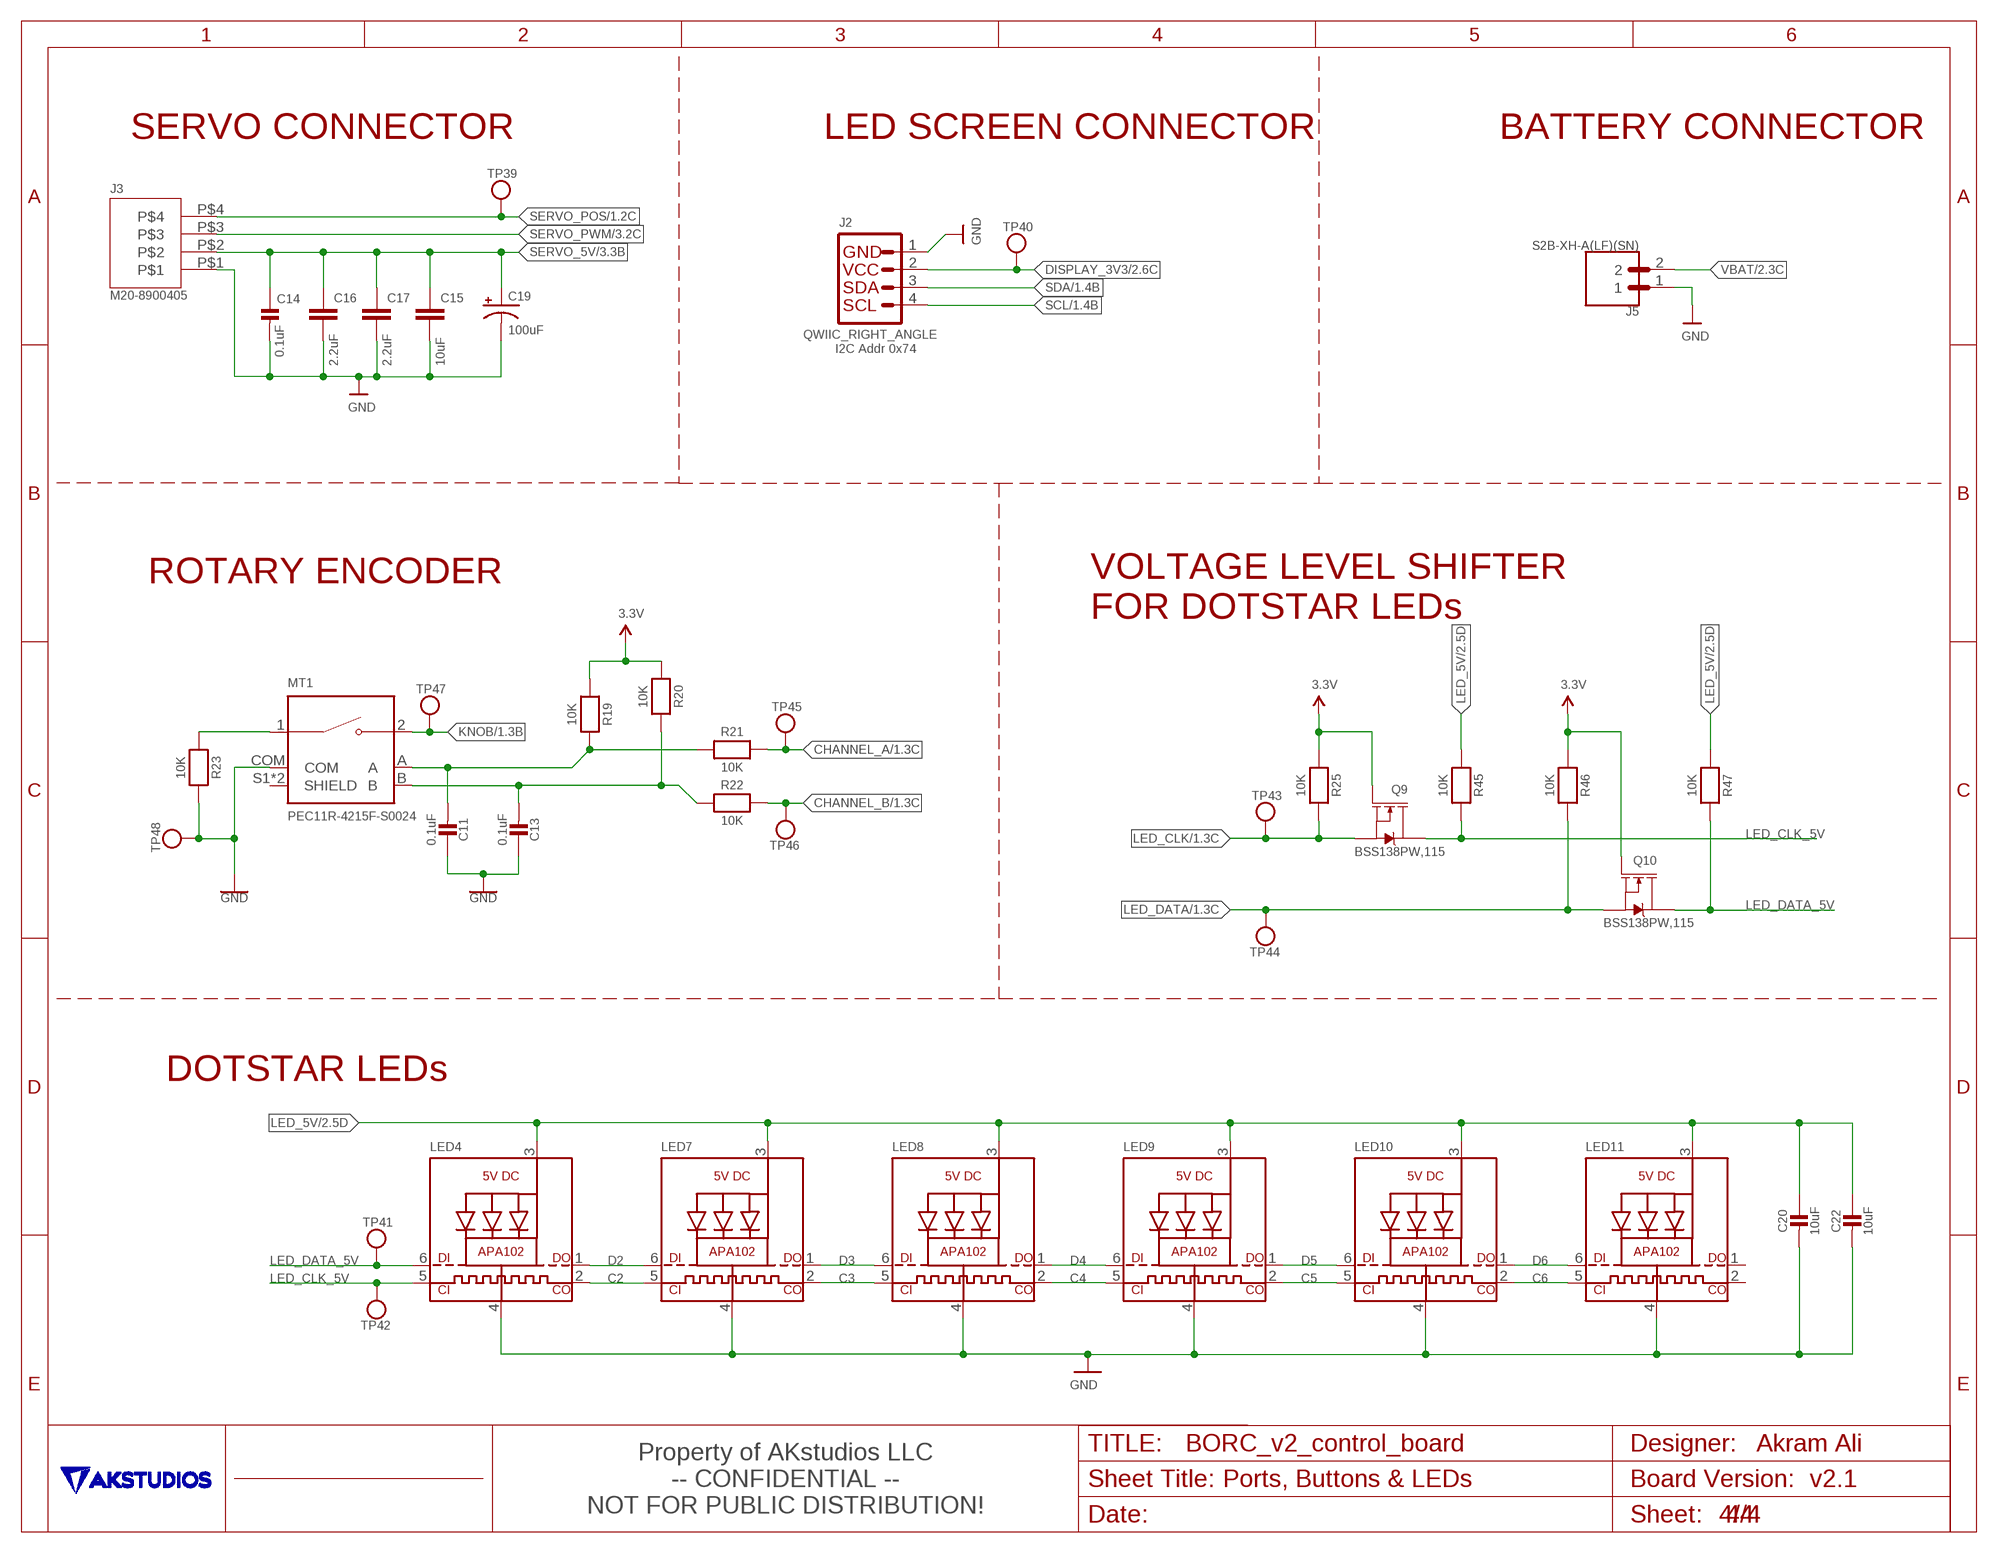
[diagram p3: schematic, sheet 4]

### Parts
C11  0.1uF  MICROBUILDER_CAP_CERAMIC_0402MP  [MICROBUILDER__0402MP]
C13  0.1uF  MICROBUILDER_CAP_CERAMIC_0402MP  [MICROBUILDER__0402MP]
C14  0.1uF  CAP_CERAMIC0805-NOOUTLINE  [0805-NO]
C15  10uF  CAP0805  [0805]
C16  2.2uF  CAP1206  [1206]
C17  2.2uF  CAP1206  [1206]
C19  100uF  100UF-POLAR-25V-20%(ELEC)  [PANASONIC_D]
C20  10uF  MICROBUILDER_CAP_CERAMIC_0402MP  [MICROBUILDER__0402MP]
C22  10uF  MICROBUILDER_CAP_CERAMIC_0402MP  [MICROBUILDER__0402MP]
J2  QWIIC_RIGHT_ANGLE  QWIIC_CONNECTORJS-1MM  [JST04_1MM_RA]
J3  M20-8900405  [M20-8900405]
J5  S2B-XH-A(LF)(SN)  [JST_S2B-XH-A(LF)(SN)]
LED4  APA102  APA1022020  [APA102_2020]
LED7  APA102  APA1022020  [APA102_2020]
LED8  APA102  APA1022020  [APA102_2020]
LED9  APA102  APA1022020  [APA102_2020]
LED10  APA102  APA1022020  [APA102_2020]
LED11  APA102  APA1022020  [APA102_2020]
MT1  PEC11R-4215F-S0024  [XDCR_PEC11R-4215F-S0024]
Q9  BSS138PW,115  MOSFET-NCH-BSS138PW,115  [SOT323]
Q10  BSS138PW,115  MOSFET-NCH-BSS138PW,115  [SOT323]
R19  10K  MICROBUILDER_RESISTOR_0402MP  [MICROBUILDER__0402MP]
R20  10K  MICROBUILDER_RESISTOR_0402MP  [MICROBUILDER__0402MP]
R21  10K  MICROBUILDER_RESISTOR_0402MP  [MICROBUILDER__0402MP]
R22  10K  MICROBUILDER_RESISTOR_0402MP  [MICROBUILDER__0402MP]
R23  10K  MICROBUILDER_RESISTOR_0402MP  [MICROBUILDER__0402MP]
R25  10K  MICROBUILDER_RESISTOR_0402MP  [MICROBUILDER__0402MP]
R45  10K  MICROBUILDER_RESISTOR_0402MP  [MICROBUILDER__0402MP]
R46  10K  MICROBUILDER_RESISTOR_0402MP  [MICROBUILDER__0402MP]
R47  10K  MICROBUILDER_RESISTOR_0402MP  [MICROBUILDER__0402MP]
TP39  RX  MICROBUILDER_TESTPOINTROUND1MM  [MICROBUILDER_TESTPOINT_ROUND_1MM]
TP40  RX  MICROBUILDER_TESTPOINTROUND1MM  [MICROBUILDER_TESTPOINT_ROUND_1MM]
TP41  RX  MICROBUILDER_TESTPOINTROUND1MM  [MICROBUILDER_TESTPOINT_ROUND_1MM]
TP42  RX  MICROBUILDER_TESTPOINTROUND1MM  [MICROBUILDER_TESTPOINT_ROUND_1MM]
TP43  RX  MICROBUILDER_TESTPOINTROUND1MM  [MICROBUILDER_TESTPOINT_ROUND_1MM]
TP44  RX  MICROBUILDER_TESTPOINTROUND1MM  [MICROBUILDER_TESTPOINT_ROUND_1MM]
TP45  RX  MICROBUILDER_TESTPOINTROUND1MM  [MICROBUILDER_TESTPOINT_ROUND_1MM]
TP46  RX  MICROBUILDER_TESTPOINTROUND1MM  [MICROBUILDER_TESTPOINT_ROUND_1MM]
TP47  RX  MICROBUILDER_TESTPOINTROUND1MM  [MICROBUILDER_TESTPOINT_ROUND_1MM]
TP48  RX  MICROBUILDER_TESTPOINTROUND1MM  [MICROBUILDER_TESTPOINT_ROUND_1MM]

### Nets
A: C11.2 MT1.A R19.2 R21.1
B: C13.2 MT1.B R20.2 R22.1
C2: LED4.2(CKO) LED7.5(CKI)
C3: LED7.2(CKO) LED8.5(CKI)
C4: LED8.2(CKO) LED9.5(CKI)
C5: LED9.2(CKO) LED10.5(CKI)
C6: LED10.2(CKO) LED11.5(CKI)
CHANNEL_A: R21.2 TP45.P$1 ; also sheet 1
CHANNEL_B: R22.2 TP46.P$1 ; also sheet 1
D2: LED4.1(DO) LED7.6(DI)
D3: LED7.1(DO) LED8.6(DI)
D4: LED8.1(DO) LED9.6(DI)
D5: LED9.1(DO) LED10.6(DI)
D6: LED10.1(DO) LED11.6(DI)
DISPLAY_3V3: J2.2 TP40.P$1 ; also sheet 2
GND [power]: C11.1 C13.1 C14.2 C15.2 C16.2 C17.2 C19.- C20.2 C22.2 J2.1 J3.P$1 J5.1 LED4.4(GND) LED7.4(GND) LED8.4(GND) LED9.4(GND) LED10.4(GND) LED11.4(GND) MT1.COM R23.2 TP48.P$1 ; also sheet 1,2,3
KNOB: MT1.2 TP47.P$1 ; also sheet 1
LED_5V: C20.1 C22.1 LED4.3(VDD) LED7.3(VDD) LED8.3(VDD) LED9.3(VDD) LED10.3(VDD) LED11.3(VDD) R45.1 R47.1 ; also sheet 2
LED_CLK: Q9.2(S) R25.2 TP43.P$1 ; also sheet 1
LED_CLK_5V: LED4.5(CKI) Q9.3(D) R45.2 TP42.P$1
LED_DATA: Q10.2(S) R46.2 TP44.P$1 ; also sheet 1
LED_DATA_5V: LED4.6(DI) Q10.3(D) R47.2 TP41.P$1
N$11: MT1.1 R23.1
SCL: J2.4 ; also sheet 1,3
SDA: J2.3 ; also sheet 1,3
SERVO_5V: C14.1 C15.1 C16.1 C17.1 C19.+ J3.P$2 ; also sheet 3
SERVO_POS: J3.P$4 TP39.P$1 ; also sheet 1
SERVO_PWM: J3.P$3 ; also sheet 3
VBAT: J5.2 ; also sheet 2,3
VCC: Q9.1(G) Q10.1(G) R19.1 R20.1 R25.1 R46.1 ; supply symbol labelled 3.3V ; also sheet 1,2,3
Unconnected: LED11.1(DO) LED11.2(CKO) MT1.S1(SHIELD) MT1.S2(SHIELD)

### Notes on the sheet
- SERVO CONNECTOR | LED SCREEN CONNECTOR | BATTERY CONNECTOR
- I2C Addr 0x74
- ROTARY ENCODER
- VOLTAGE LEVEL SHIFTER
  FOR DOTSTAR LEDs
- DOTSTAR LEDs
- Akram Ali
- Property of AKstudios LLC
- v2.1
- -- CONFIDENTIAL --
  NOT FOR PUBLIC DISTRIBUTION!

## Library data of the parts
C1 C7 = SparkFun-Capacitors:0.33UF/330NF: 0.33µF/330nF ceramic capacitors A capacitor is a passive two-terminal electrical component used to store electrical energy temporarily in an electric field.; MPN: GRM219R71H334KA88D; PROD_ID: CAP-08469
C2-C4 C6 C8-C13 C18 C20-C26 = Adafruit Feather 32u4 Bluefruit LE:MICROBUILDER_CAP_CERAMIC: Ceramic Capacitors For new designs, use the packages preceded by an '_' character since they are more reliable: The following footprints should be used on most boards: _0402 - Standard footprint for regular board layouts _0603 - Standard footprint for regular board layouts _0805 - Standard footprint for regular board layouts _1206 - Standard footprint for regular board layouts For extremely tight-pitch boards where space is at a premium, the following 'micro-pitch' footprints can be used (smaller pads, no silkscreen outline, etc.): _0402MP - Micro-pitch footprint for very dense/compact boards _0603MP - Micro-pitch footprint for very dense/compact boards _0805MP - Micro-pitch footprint for very dense/compact boards _1206MP - Micro-pitch footprint for very dense/compact boards; MPN: GRM155R71H104KE14D
C14 = microbuilder:CAP_CERAMIC: Ceramic Capacitors For new designs, use the packages preceded by an '_' character since they are more reliable: The following footprints should be used on most boards: _0402 - Standard footprint for regular board layouts _0603 - Standard footprint for regular board layouts _0805 - Standard footprint for regular board layouts _1206 - Standard footprint for regular board layouts For extremely tight-pitch boards where space is at a premium, the following 'micro-pitch' footprints can be used (smaller pads, no silkscreen outline, etc.): _0402MP - Micro-pitch footprint for very dense/compact boards _0603MP - Micro-pitch footprint for very dense/compact boards _0805MP - Micro-pitch footprint for very dense/compact boards _1206MP - Micro-pitch footprint for very dense/compact boards; MPN: CC0805KRX7R9BB104
C15 = SparkFun-Passives:CAP: Capacitor Standard 0603 ceramic capacitor, and 0.1" leaded capacitor.; MPN: GRM21BR61H106KE43L
C16 C17 = SparkFun-Passives:CAP: Capacitor Standard 0603 ceramic capacitor, and 0.1" leaded capacitor.
C19 = SparkFun-Capacitors:100UF-POLAR: 100µF polarized capacitors A capacitor is a passive two-terminal electrical component used to store electrical energy temporarily in an electric field.; MPN: A768EB107M1ELAS036; PROD_ID: CAP-12547
C30 = Adafruit Feather 32u4 Bluefruit LE:MICROBUILDER_CAP_CERAMIC: Ceramic Capacitors For new designs, use the packages preceded by an '_' character since they are more reliable: The following footprints should be used on most boards: _0402 - Standard footprint for regular board layouts _0603 - Standard footprint for regular board layouts _0805 - Standard footprint for regular board layouts _1206 - Standard footprint for regular board layouts For extremely tight-pitch boards where space is at a premium, the following 'micro-pitch' footprints can be used (smaller pads, no silkscreen outline, etc.): _0402MP - Micro-pitch footprint for very dense/compact boards _0603MP - Micro-pitch footprint for very dense/compact boards _0805MP - Micro-pitch footprint for very dense/compact boards _1206MP - Micro-pitch footprint for very dense/compact boards; MPN: GRM155R61A106ME11D
D1 = microbuilder:DIODE-SCHOTTKY; MPN: STPS140Z
D2 D9 D11 = ESD_diodes:SP0402U-ULC-01ETG; MPN: SP0402U-ULC-01ETG
D4 = microbuilder:DIODE-SCHOTTKY; MPN: MBR260HW
F1 = SparkFun-Fuses:PPTC: Resettable Fuse PPTC Resettable Fuse. Really a sort of resistor with a polymeric positive temperature coefficient whose resistance increases dramatically with an increase in temperature. When heated by the power passing through the resistance rises causing the current to be limited, protecting the circuit. This is achieved by the transition of the polymer from a crystalline to an amorphous state where the conductive carbon separates breaking the conductive pathways found in the cool crystalline structure. When a PPTC cools back down it resumes conducting letting the circuit turn back on. SparkFun Products: SparkFun RedBoard - Programmed with Arduino <https://www.sparkfun.com/products/12757> Pro Micro - 5V/16MHz <https://www.sparkfun.com/products/12640> Arduino Pro 328 - 5V/16MHz <https://www.sparkfun.com/products/10915> MP3 Trigger <https://www.sparkfun.com/products/13720>; MPN: MF-PSML110/6-2; PROD_ID: RES-13945; VALUE: 6V 0.5A
FID1-FID4 = SHT31:FIDUCIAL: Fiducial Alignment Points Various fiducial points for machine vision alignment.; BOM: EXCLUDE
J1 = SparkFun-Connectors:USB_C: USB Type C 16Pin Connector Super Speed pins not available on the 16-pin purely SMD connector so this part is best for USB 2.0 implementations. D1 and D2 are tied together enabling D+/- no matter which way the cable is plugged into the connector. The two channel configuration pins (CC1/2) are exposed. These are normally connected to ground via 5.1k resistors but can be reconfigured for high current/high power applications. **4-LAYER BOARD WARNING!!** If designing 4-layer board, make sure to select the variant _4-LAYER-ISOLATED. The linked footprint (USB-C-16-4LAYER-ISOLATED) includes some very necessary cutout polygons in the inner layers (2 and 15). This prevents the PTH mounting shield legs on the USB connector from electrically connecting any other polygons on the inner layers (usually VCC and GND).; MPN: USB4105-GF-A; PROD_ID: CONN-14122
J2 = SparkFun-Connectors:QWIIC_CONNECTOR: SparkFun I2C Standard Qwiic Connector An SMD 1mm pitch JST connector makes it easy and quick (get it? Qwiic?) to connect I2C devices to each other. The Qwiic system <http://www.sparkfun.com/qwiic> enables fast and solderless connection between popular platforms and various sensors and actuators. We carry 200mm <https://www.sparkfun.com/products/14204>, 100mm <https://www.sparkfun.com/products/14205>, 50mm <https://www.sparkfun.com/products/14206>, and breadboard friendly <https://www.sparkfun.com/products/14207> Qwiic cables. We also offer 10 pcs strips <https://www.sparkfun.com/products/14323> the SMD connectors.; MPN: SM04B-SRSS-TB(LF)(SN); PROD_ID: CONN-13694
J3 = M20-8900405:M20-8900405: M20-8900405 - Header - 4-pin Male (SMD, 0.1", Right Angle) Datasheet: https://cdn.harwin.com/pdfs/C001XX_M20_Series_Connectors.pdf Same as SparkFun PRT-12638 <https://www.sparkfun.com/products/12638> Designed by AKstudios <https://github.com/akstudios>; MPN: M20-8900405
J4 = SparkFun-Connectors:CONN_01: Single connection point. Often used as Generic Header-pin footprint for 0.1 inch spaced/style header connections On any of the 0.1 inch spaced packages, you can populate with these: Break Away Headers - Straight <https://www.sparkfun.com/products/116> (PRT-00116) Break Away Male Headers - Right Angle <https://www.sparkfun.com/products/553> (PRT-00553) Female Headers <https://www.sparkfun.com/products/115> (PRT-00115) Break Away Headers - Machine Pin <https://www.sparkfun.com/products/117> (PRT-00117) Break Away Female Headers - Swiss Machine Pin <https://www.sparkfun.com/products/743> (PRT-00743) This device is also useful as a general connection point to wire up your design to another part of your project. Our various solder wires solder well into these plated through hole pads. Hook-Up Wire - Assortment (Stranded, 22 AWG) <https://www.sparkfun.com/products/11375> (PRT-11375) Hook-Up Wire - Assortment (Solid Core, 22 AWG) <https://www.sparkfun.com/products/11367> (PRT-11367) View the entire wire category on our website here <https://www.sparkfun.com/categories/141> Special notes: SMTSO-256-ET is a "flush mount" nut for a 4-40 screw. We mostly use this on specialty testbeds; it is a nice way to connect hardware to your PCB at an adjustable hieght. Also note, the SNAP packages are for using a snappable style connector. We sell a baggie of snaps and they are also used on two LilyPad designs: Snap Assortment - 30 pack (male and female) <https://www.sparkfun.com/products/11347> (DEV-11347) LilyPad Arduino SimpleSnap <https://www.sparkfun.com/products/10941> (DEV-10941) LilyPad SimpleSnap Protoboard <https://www.sparkfun.com/products/10940> (DEV-10940)
J5 = S2B-XH-A_LF__SN_:S2B-XH-A(LF)(SN): XH Series 2.5mm 2 Position Through Hole Shrouded Header Connector; AVAILABILITY: Unavailable; DESCRIPTION: Connector Header Through Hole, Right Angle 2 position 0.098 (2.50mm); MF: JST Sales; MP: S2B-XH-A(LF)(SN); PACKAGE: None; PRICE: None
LED1 LED13 = Seeed-LED:SMD-LED-CLEAR-BLUE(0402): 304090075; MPN: IN-S42ATR; VALUE: BLUE-0402
LED4 LED7-LED11 = microbuilder:APA102: APA102/DotStar Pixels VCC: 5V DC Refresh Rate: 400Hz; MPN: APA102-2020
LED5 = Seeed-LED:SMD-LED-CLEAR-BLUE(0402): 304090075; MPN: IN-S42ATB; VALUE: BLUE-0402
LED12 = Seeed-LED:SMD-LED-CLEAR-BLUE(0402): 304090075; MPN: IN-S42ATG; VALUE: BLUE-0402
LED14 = Seeed-LED:SMD-LED-CLEAR-BLUE(0402): 304090075; MPN: IN-S42ATY; VALUE: BLUE-0402
MH1 U$3 U$4 U$7 = ADS1x15:MOUNTINGHOLE: Mounting Hole For #2 screws (0.086"/2.18mm width, 0.094"/2.4mm hole) use 2.5mm
MT1 = PEC11R-4215F-S0024:PEC11R-4215F-S0024: Incremental Encoder, 12 Mm, Contact Rating 10 Ma - 5 Vdc Check prices <https://pricing.snapeda.com/parts/PEC11R-4215F-S0024/Bourns/view-part?ref=eda>; AVAILABILITY: Warning; DESCRIPTION: Rotary Encoder Mechanical 24 Quadrature (Incremental) Vertical; MF: Bourns; MP: PEC11R-4215F-S0024; MPN: PEC11R-4215F-S0024; PACKAGE: None; PRICE: None; PURCHASE-URL: https://pricing.snapeda.com/search/part/PEC11R-4215F-S0024/?ref=eda
Q1 Q2 Q5 Q7 Q11 = MOSFETs:MOSFET-PCH: P-channel MOSFETs SOT23-3 and SOT323 (SC70) packages Designed by AKstudios; MPN: SSM3J374R,LF; VALUE: BSS84-7-F
Q3 Q9 Q10 = MOSFETs:MOSFET-NCH: N-channel MOSFETs SOT23-3 and SOT323 (SC70) packages Designed by AKstudios; MPN: BSS138PW,115
Q4 Q6 Q16 = SOT65P210X100-3N:UMT3904T106; MPN: UMT3904T106
R1 R6 R7 R27 R36 R40 R48 = Adafruit Feather 32u4 Bluefruit LE:MICROBUILDER_RESISTOR: Resistors For new designs, use the packages preceded by an '_' character since they are more reliable: The following footprints should be used on most boards: _0402 - Standard footprint for regular board layouts _0603 - Standard footprint for regular board layouts _0805 - Standard footprint for regular board layouts _1206 - Standard footprint for regular board layouts For extremely tight-pitch boards where space is at a premium, the following 'micro-pitch' footprints can be used (smaller pads, no silkscreen outline, etc.): _0402MP - Micro-pitch footprint for very dense/compact boards _0603MP - Micro-pitch footprint for very dense/compact boards _0805MP - Micro-pitch footprint for very dense/compact boards _1206MP - Micro-pitch footprint for very dense/compact boards; MPN: RC0402FR-071KL
R2 R8 R15 R16 R19-R25 R28-R33 R35 R44-R47 R49 R50 = Adafruit Feather 32u4 Bluefruit LE:MICROBUILDER_RESISTOR: Resistors For new designs, use the packages preceded by an '_' character since they are more reliable: The following footprints should be used on most boards: _0402 - Standard footprint for regular board layouts _0603 - Standard footprint for regular board layouts _0805 - Standard footprint for regular board layouts _1206 - Standard footprint for regular board layouts For extremely tight-pitch boards where space is at a premium, the following 'micro-pitch' footprints can be used (smaller pads, no silkscreen outline, etc.): _0402MP - Micro-pitch footprint for very dense/compact boards _0603MP - Micro-pitch footprint for very dense/compact boards _0805MP - Micro-pitch footprint for very dense/compact boards _1206MP - Micro-pitch footprint for very dense/compact boards; MPN: RC0402FR-7W10KL
R3 R5 R17 R18 = Adafruit Feather 32u4 Bluefruit LE:MICROBUILDER_RESISTOR: Resistors For new designs, use the packages preceded by an '_' character since they are more reliable: The following footprints should be used on most boards: _0402 - Standard footprint for regular board layouts _0603 - Standard footprint for regular board layouts _0805 - Standard footprint for regular board layouts _1206 - Standard footprint for regular board layouts For extremely tight-pitch boards where space is at a premium, the following 'micro-pitch' footprints can be used (smaller pads, no silkscreen outline, etc.): _0402MP - Micro-pitch footprint for very dense/compact boards _0603MP - Micro-pitch footprint for very dense/compact boards _0805MP - Micro-pitch footprint for very dense/compact boards _1206MP - Micro-pitch footprint for very dense/compact boards; MPN: RC0402FR-0710ML
R4 R41 R42 = Adafruit Feather 32u4 Bluefruit LE:MICROBUILDER_RESISTOR: Resistors For new designs, use the packages preceded by an '_' character since they are more reliable: The following footprints should be used on most boards: _0402 - Standard footprint for regular board layouts _0603 - Standard footprint for regular board layouts _0805 - Standard footprint for regular board layouts _1206 - Standard footprint for regular board layouts For extremely tight-pitch boards where space is at a premium, the following 'micro-pitch' footprints can be used (smaller pads, no silkscreen outline, etc.): _0402MP - Micro-pitch footprint for very dense/compact boards _0603MP - Micro-pitch footprint for very dense/compact boards _0805MP - Micro-pitch footprint for very dense/compact boards _1206MP - Micro-pitch footprint for very dense/compact boards; MPN: RC0402FR-07100RL
R9 R10 = Adafruit Feather 32u4 Bluefruit LE:MICROBUILDER_RESISTOR: Resistors For new designs, use the packages preceded by an '_' character since they are more reliable: The following footprints should be used on most boards: _0402 - Standard footprint for regular board layouts _0603 - Standard footprint for regular board layouts _0805 - Standard footprint for regular board layouts _1206 - Standard footprint for regular board layouts For extremely tight-pitch boards where space is at a premium, the following 'micro-pitch' footprints can be used (smaller pads, no silkscreen outline, etc.): _0402MP - Micro-pitch footprint for very dense/compact boards _0603MP - Micro-pitch footprint for very dense/compact boards _0805MP - Micro-pitch footprint for very dense/compact boards _1206MP - Micro-pitch footprint for very dense/compact boards; MPN: RC0402FR-074K7L
R11 R12 = Adafruit Feather 32u4 Bluefruit LE:MICROBUILDER_RESISTOR: Resistors For new designs, use the packages preceded by an '_' character since they are more reliable: The following footprints should be used on most boards: _0402 - Standard footprint for regular board layouts _0603 - Standard footprint for regular board layouts _0805 - Standard footprint for regular board layouts _1206 - Standard footprint for regular board layouts For extremely tight-pitch boards where space is at a premium, the following 'micro-pitch' footprints can be used (smaller pads, no silkscreen outline, etc.): _0402MP - Micro-pitch footprint for very dense/compact boards _0603MP - Micro-pitch footprint for very dense/compact boards _0805MP - Micro-pitch footprint for very dense/compact boards _1206MP - Micro-pitch footprint for very dense/compact boards; MPN: RC0402FR-135K1L
R13 R14 = Adafruit Feather 32u4 Bluefruit LE:MICROBUILDER_RESISTOR: Resistors For new designs, use the packages preceded by an '_' character since they are more reliable: The following footprints should be used on most boards: _0402 - Standard footprint for regular board layouts _0603 - Standard footprint for regular board layouts _0805 - Standard footprint for regular board layouts _1206 - Standard footprint for regular board layouts For extremely tight-pitch boards where space is at a premium, the following 'micro-pitch' footprints can be used (smaller pads, no silkscreen outline, etc.): _0402MP - Micro-pitch footprint for very dense/compact boards _0603MP - Micro-pitch footprint for very dense/compact boards _0805MP - Micro-pitch footprint for very dense/compact boards _1206MP - Micro-pitch footprint for very dense/compact boards; MPN: RC0402FR-0727RL
R26 = Adafruit Feather 32u4 Bluefruit LE:MICROBUILDER_RESISTOR: Resistors For new designs, use the packages preceded by an '_' character since they are more reliable: The following footprints should be used on most boards: _0402 - Standard footprint for regular board layouts _0603 - Standard footprint for regular board layouts _0805 - Standard footprint for regular board layouts _1206 - Standard footprint for regular board layouts For extremely tight-pitch boards where space is at a premium, the following 'micro-pitch' footprints can be used (smaller pads, no silkscreen outline, etc.): _0402MP - Micro-pitch footprint for very dense/compact boards _0603MP - Micro-pitch footprint for very dense/compact boards _0805MP - Micro-pitch footprint for very dense/compact boards _1206MP - Micro-pitch footprint for very dense/compact boards; MPN: RC0402FR-13220RL
R39 = microbuilder:RESISTOR: Resistors 0402 - 0402 Surface Mount Package 22 Ohm 1% 1/16W [Digikey: 311-22.0LRTR-ND] 33 Ohm 5% 1/16W 1.0K 5% 1/16W 1.5K 5% 1/16W 2.0K 1% 1/16W 10.0K 1% 1/16W [Digikey: 311-10.0KLRTR-ND] 10.0K 5% 1/16W [Digikey: RMCF0402JT10K0TR-ND] 12.1K 1% 1/16W [Digikey: 311-22.0LRTR-ND] 100.0K 5% 1/16W 0603 - 0603 Surface Mount Package 0 Ohm 1/10 Watt 1% Resistor 15 Ohm 1/10 Watt 1% Resistor 33 Ohm 1/10 Watt 1% Resistor 49.9 Ohm 1/10 Watt 1% Resistor 100 Ohm 1/10 Watt 1% Resistor 150 Ohm 1/10 Watt 1% Resistor 240 Ohm 1/10 Watt 1% Resistor 390 Ohm 1/10 Watt 1% Resistor 560 Ohm 1/10 Watt 1% Resistor 680 Ohm 1/10 Watt 1% Resistor 750 Ohm 1/10 Watt 1% Resistor 1.0K Ohm 1/10 Watt 1% Resistor 1.5K Ohm 1/10 Watt 1% Resistor 2.0K Ohm 1/10 Watt 1% Resistor 2.2K Ohm 1/10 Watt 1% Resistor 3.3K Ohm 1/10 Watt 1% Resistor 4.7K Ohm 1/10 Watt 1% Resistor 10.0K Ohm 1/10 Watt 1% Resistor 12.0K Ohm 1/10 Watt 1% Resistor 12.1K Ohm 1/10 Watt 1% Resistor 20.0K Ohm 1/10 Watt 1% Resistor 33.0K Ohm 1/10 Watt 1% Resistor 100.0K Ohm 1/10 Watt 1% Resistor 0805 - 0805 Surface Mount Package 0 Ohm 1/8 Watt 1% Resistor 33 Ohm 1/8 Watt 1% Resistor 100 Ohm 1/8 Watt 1% Resistor 150 Ohm 1/8 Watt 1% Resistor 200 Ohm 1/8 Watt 1% Resistor 240 Ohm 1/8 Watt 1% Resistor 330 Ohm 1/8 Watt 1% Resistor 390 Ohm 1/8 Watt 1% Resistor 470 Ohm 1/8 Watt 1% Resistor 1.0K Ohm 1/8 Watt 1% Resistor 1.5K Ohm 1/8 Watt 1% Resistor 2.0K Ohm 1/8 Watt 1% Resistor 4.7K Ohm 1/8 Watt 1% Resistor 5.1K Ohm 1/8 Watt 1% Resistor 5.6K Ohm 1/8 Watt 1% Resistor 10.0K Ohm 1/8 Watt 1% Resistor 22.0K Ohm 1/8 Watt 1% Resistor 33.0K Ohm 1/8 Watt 1% Resistor 100K Ohm 1/8 Watt 1% Resistor 1206 - 1206 Surface Mount Package 2012 - 2010 Surface Mount Package 0.11 Ohm 1/2 Watt 1% Resistor - Digikey: RHM.11UCT-ND; MPN: RCWE2512R100FKEA
SW1 = adafruit:SPST_TACT: SMT 6mm switch, EVQQ2 series http://www.ladyada.net/library/eagle; MPN: KMR221GLFS
TC1 = TagConnect:TC2030-IDC: Tag-Connect In Circuit Programming & Debug Cable 6 Pin http://www.tag-connect.com
TP1-TP21 TP23-TP26 TP28-TP33 TP35 TP38-TP48 = Adafruit Feather 32u4 Bluefruit LE:MICROBUILDER_TESTPOINT: Test Point Various test points for characterisation and PCB testing TESTPOINT_SMT - Compact Surface Mount Test Point [Digikey: 5016KTR-ND]
U1 = ATMEGA1284P-MU:ATMEGA1284P-MU: ATMEGA1284P-MU, 8 bit AVR Microcontroller 20MHz 4, 128kb Flash, 16kb RAM, I2C SPI 44-Pin VQFN Source: Datasheet <https://componentsearchengine.com/Datasheets/1/ATMEGA1284P-MU.pdf> Check prices <https://pricing.snapeda.com/parts/ATMEGA1284P-MU/Microchip/view-part?ref=eda>; AVAILABILITY: Warning; DESCRIPTION: AVR AVR® ATmega Microcontroller IC 8-Bit 20MHz 128KB (64K x 16) FLASH 44-VQFN (7x7); MF: Microchip; MP: ATMEGA1284P-MU; MPN: ATMEGA1284P-MU; PACKAGE: VQFN-44 Microchip; PRICE: None; PURCHASE-URL: https://pricing.snapeda.com/search/part/ATMEGA1284P-MU/?ref=eda
U2 = SHT40-AD1B-R3:SHT40-AD1B-R3; MPN: SHT40-BD1B-R3
U3 = PCA9685:PCA9685: 16-channel 12-bit PWM I2C interface Internal Oscillator 40Hz to 1kHz Can be totem pole or open collector 2.3V to 5.5V SparkFun Products SparkFun Block for Intel® Edison - PWM <https://www.sparkfun.com/products/13042> (DEV-13042) PROTO: IC-12240 PROD_ID: IC-12271; MPN: PCA9685BS,118
U4 = linear:MCP1703: 250 mA, 16V, Low Quiescent Current LDO Regulator Source: http://ww1.microchip.com/downloads/en/DeviceDoc/22049b.pdf; MPN: MCP1703T-3302E/CB
U5 = Pololu Step Up Vregs:POLOLU_STEPUP_U3V40X; MPN: U3V40F5
U6 = SparkFun-RF:RFM69H: Hope RF RFM69H ISM Transceiver Module The RFM69H is a transceiver module capable of operation over a wide frequency range, including the 315,433,868 and 915MHz license-free ISM (Industry Scientific and Medical) frequency bands. All major RF communication parameters are programmable and most of them can be dynamically set. The RFM69H offers the unique advantage of programmable narrow-band and wide- band communication modes. The RFM69H is optimized for low power consumption while offering high RF output power and channelized operation.Compliance ETSI and FCC regulations. Datasheet <http://www.hoperf.cn/upload/docs/RF/SX/RFM69H_DataSheet_v1.3.pdf> SparkFun Products RFM69HCW Wireless Transceiver - 915MHz <https://www.sparkfun.com/products/13909> (COM-13909) RFM69HCW Wireless Transceiver - 434MHz <https://www.sparkfun.com/products/13910> (COM-13910) SparkFun RFM69 Breakout (915MHz) <https://www.sparkfun.com/products/12775> (WRL-12775) SparkFun RFM69 Breakout (434MHz) <https://www.sparkfun.com/products/12823> (WRL-12823); PROD_ID: IC-11997
U7 = LowPowerLab:AT25F512B: 4-Mbit SPI flash memory; MPN: W25X40CLSNIG
U8 = ftdi_ft231xq-r:FT231XQ-R: This is the 20-LD QFN package of the FTDI FT231XQ-R chip.
U9 = microbuilder:MCP73833: Lithium-Polymer/Lithium-Ion Battery Charger [Part No.] Microchip MCP73833 MSOP10 (tube only): Digikey: MCP73833T-AMI/UN or MCP73833-FCI/UN-ND Mouser: 579-MCP73833-AMI/UN DFN10 (tape): Digikey: Note Chips ending in 'AMI' have no timer, and chips ending in 'FCI' have a 6-hour timer that will end the charge sequence after 6 horus regqrdless of current charge level.; MPN: MCP73833T-AMI/MF
U11 = microbuilder:INA219: INA219 - I2C Current/Power Monitor Voltage Range: 0-26V Accuracy: 0.5% Temperature: -40°C - 125°C; MPN: INA219AIDCNR
Y1 = SparkFun:RESONATOR: Resonator Small SMD resonator. This is the itty bitty 10/20MHz resonators with built in caps. CSTCE10M0G55 and CSTCE20M0V53. Footprint has been reviewed closely but hasn't been tested yet.; MPN: CSTNE16M0V530000R0

## Net classes
1 power: width 0.127 mm, clearance 0.127 mm